# EAGLE design power_backup_v2 (EAGLE 6.5.0)
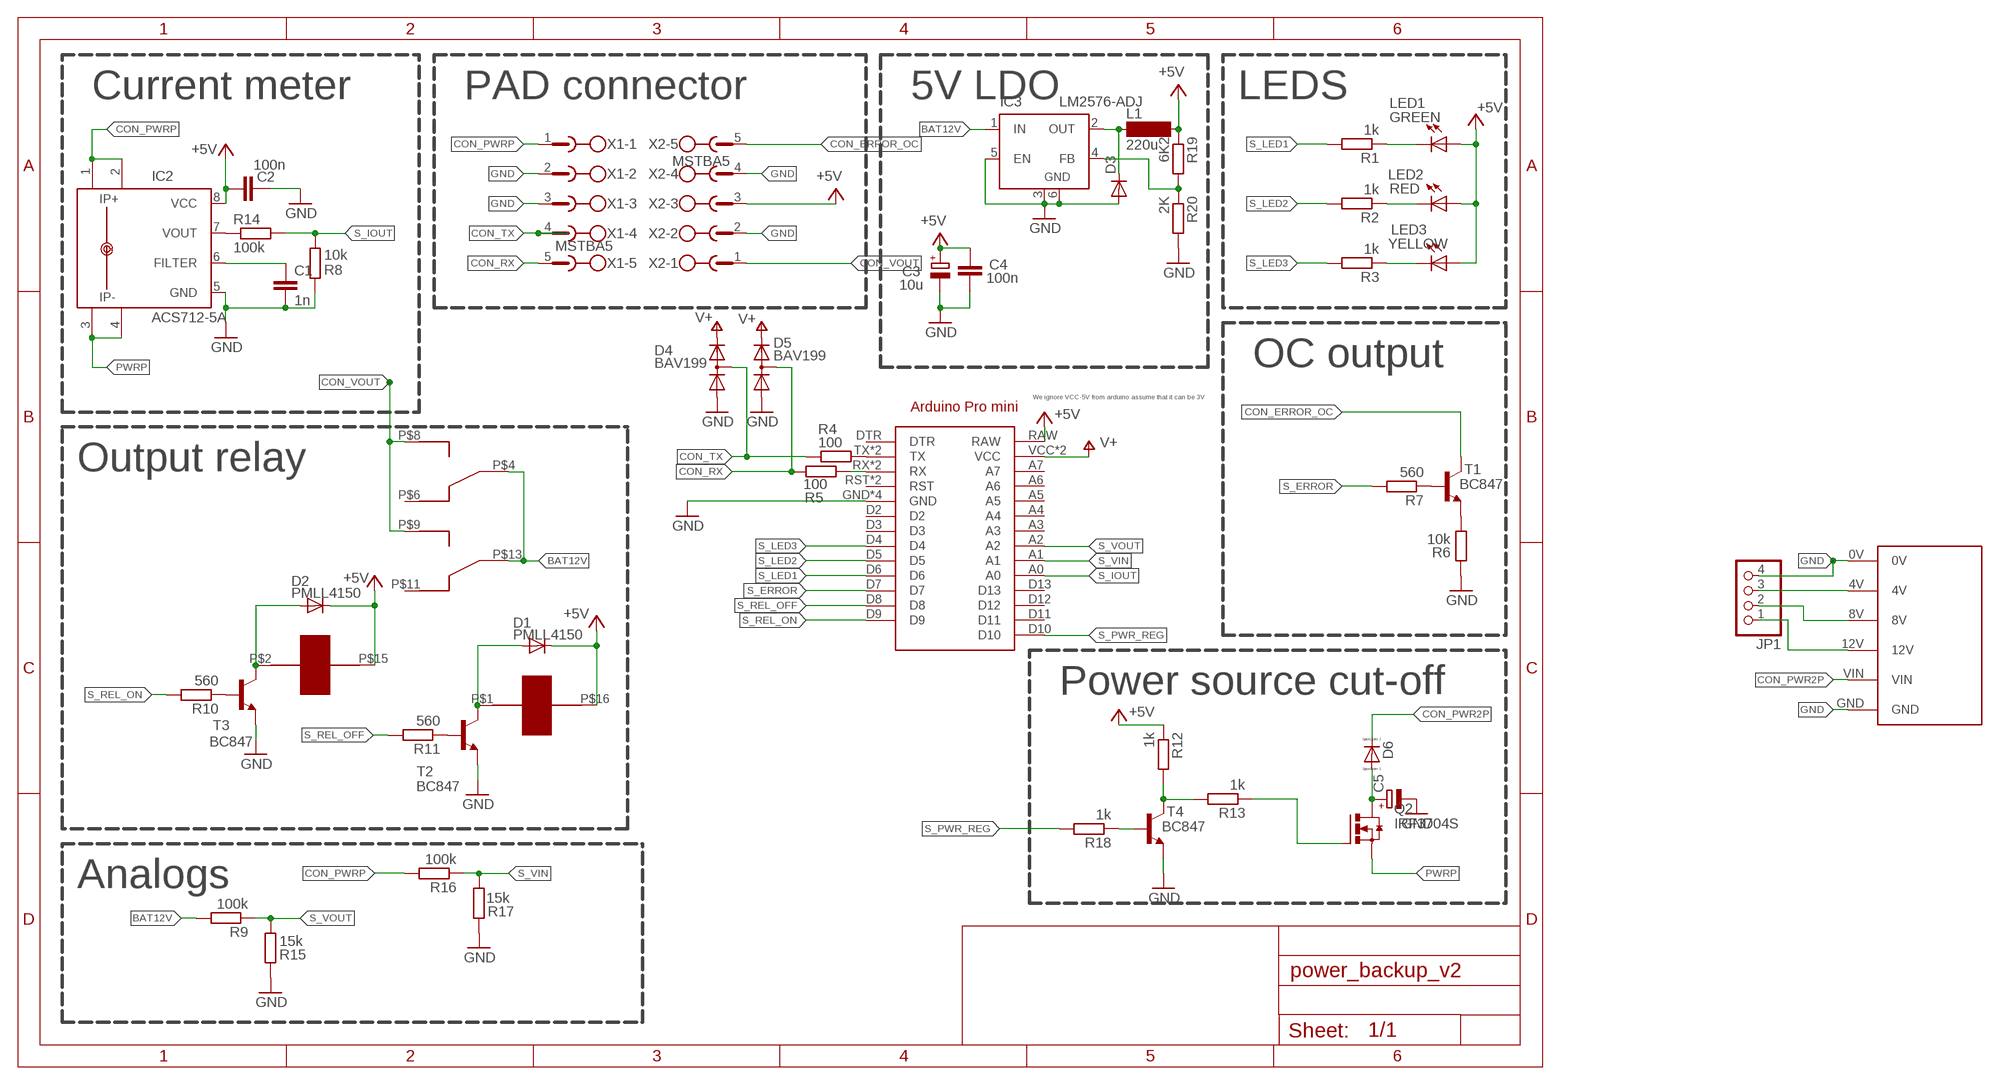
[diagram p0: schematic, sheet 1]

## Parts
ARDUINO1  ARDUINO_PRO_MINI  [ARDUINO_PRO_MINI]
C1  1n  C-EUC0805  [C0805]
C2  100n  C-EUC0805  [C0805]
C3  10u  CPOL-EUSMCC  [SMC_C]
C4  100n  C-EUC0805  [C0805]
C5  CPOL-EUE3.5-8  [E3,5-8]
D1  PMLL4150  [SOD80C]
D2  PMLL4150  [SOD80C]
D3  DIODE-DO214AA  [DO214AA]
D4  BAV199  [SOT23]
D5  BAV199  [SOT23]
D6  DIODE_E-SMC  [DIODE_SMC]
IC2  ACS712-5A  ACS712-LC  [SOIC8]
IC3  LM2576-ADJ  LM2596S  [TO263-5]
JP1  PINHD-1X4  [1X04]
K2  HFD2/003  [RELAY]
L1  220u  MS85  [MS85]
LED1  GREEN  LED3MM  [LED3MM]
LED2  RED  LED3MM  [LED3MM]
LED3  YELLOW  LED3MM  [LED3MM]
Q2  IRF3704S  [D2PACK]
R1  1k  R-EU_M0805  [M0805]
R2  1k  R-EU_M0805  [M0805]
R3  1k  R-EU_M0805  [M0805]
R4  100  R-EU_M0805  [M0805]
R5  100  R-EU_M0805  [M0805]
R6  10k  R-EU_M0805  [M0805]
R7  560  R-EU_M0805  [M0805]
R8  10k  R-EU_M0805  [M0805]
R9  100k  R-EU_M0805  [M0805]
R10  560  R-EU_M0805  [M0805]
R11  560  R-EU_M0805  [M0805]
R12  1k  R-EU_M0805  [M0805]
R13  1k  R-EU_M0805  [M0805]
R14  100k  R-EU_M0805  [M0805]
R15  15k  R-EU_M0805  [M0805]
R16  100k  R-EU_M0805  [M0805]
R17  15k  R-EU_M0805  [M0805]
R18  1k  R-EU_M0805  [M0805]
R19  6K2  R-EU_M0805  [M0805]
R20  2K  R-EU_M0805  [M0805]
T1  BC847  [SOT23]
T2  BC847  [SOT23]
T3  BC847  [SOT23]
T4  BC847  [SOT23]
U$1  BALANCER  [BALANCER]
X1  MSTBA5  [MSTBA5]
X2  MSTBA5  [MSTBA5]

## Nets
+5V: ARDUINO1.RAW C2.1 C3.+ C4.1 D1.C D2.C IC2.8(VCC) K2.P$15 K2.P$16 L1.2 LED1.A LED2.A LED3.A R12.1 R19.1 X2.3
BAT4V: JP1.3 U$1.4V
BAT8V: JP1.2 U$1.8V
BAT12V: IC3.1(IN) JP1.1 K2.P$4(MID) K2.P$13(MID) R9.2 U$1.12V
CON_ERROR_OC: T1.3(C) X2.5
CON_PWR2P: D6.C(A) U$1.VIN
CON_PWRP: IC2.1(IP+) IC2.2(IP+1) R16.2 X1.1
CON_RX: D5.3(AC) R5.1 X1.5
CON_TX: D4.3(AC) R4.1 X1.4
CON_VOUT: K2.P$8(NO) K2.P$9(NO) X2.1
GND: ARDUINO1.GND ARDUINO1.GND@1(GND) ARDUINO1.GND@2(GND) ARDUINO1.GND@3(GND) C1.2 C2.2 C3.- C4.2 C5.- D3.A D4.1(A) D5.1(A) IC2.5(GND) IC3.3(GND) IC3.5(EN) IC3.6(GND) JP1.4 R6.1 R8.2 R15.2 R17.2 R20.2 T2.2(E) T3.2(E) T4.2(E) U$1.0V U$1.GND X1.2 X1.3 X2.2 X2.4
N$1: LED1.K(C) R1.1
N$2: LED2.K(C) R2.1
N$3: LED3.K(C) R3.1
N$4: C5.+ D6.A(C) Q2.2(D)
N$6: D1.A K2.P$1 T2.3(C)
N$7: D2.A K2.P$2 T3.3(C)
N$8: R10.1 T3.1(B)
N$9: R11.1 T2.1(B)
N$10: R12.2 R13.2 T4.3(C)
N$11: Q2.1(G) R13.1
N$12: C1.1 IC2.6(FILTER)
N$13: IC2.7(VOUT) R14.1
N$14: R7.1 T1.1(B)
N$15: R6.2 T1.2(E)
N$16: R18.1 T4.1(B)
N$17: ARDUINO1.TX ARDUINO1.TX@1(TX) R4.2
N$18: ARDUINO1.RX ARDUINO1.RX@1(RX) R5.2
N$22: D3.C IC3.2(OUT) L1.1
N$23: IC3.4(FB) R19.2 R20.1
PWRP: IC2.3(IP-) IC2.4(IP-1) Q2.3(S)
S_ERROR: ARDUINO1.D7 R7.2
S_IOUT: ARDUINO1.A0 R8.1 R14.2
S_LED1: ARDUINO1.D6 R1.2
S_LED2: ARDUINO1.D5 R2.2
S_LED3: ARDUINO1.D4 R3.2
S_PWR_REG: ARDUINO1.D10 R18.2
S_REL_OFF: ARDUINO1.D8 R11.2
S_REL_ON: ARDUINO1.D9 R10.2
S_VIN: ARDUINO1.A1 R16.1 R17.1
S_VOUT: ARDUINO1.A2 R9.1 R15.1
V+: ARDUINO1.VCC ARDUINO1.VCC@1(VCC) D4.2(C) D5.2(C)
Unconnected: ARDUINO1.A3 ARDUINO1.A4 ARDUINO1.A5 ARDUINO1.A6 ARDUINO1.A7 ARDUINO1.D2 ARDUINO1.D3 ARDUINO1.D11 ARDUINO1.D12 ARDUINO1.D13 ARDUINO1.DTR ARDUINO1.RST ARDUINO1.RST@1(RST) K2.P$6(NC) K2.P$11(NC)

## Notes on the sheet
- Current meter | PAD connector | 5V LDO | LEDS
- OC output
- We ignore VCC-5V from arduino assume that it can be 3V
- Output relay
- Power source cut-off
- Analogs

## Library data of the parts
ARDUINO1 = arduinopromini:ARDUINO_PRO_MINI: For creating Arduino Pro Mini shields
C1 C2 C4 = rcl:C-EU: CAPACITOR, European symbol
C3 C5 = rcl:CPOL-EU: POLARIZED CAPACITOR, European symbol
D1 D2 = diode:PMLL4150: DIODE high speed
D3 = diode:DIODE-: DIODE
D4 D5 = diode:BAV199: DIODE low-leakage double diode
D6 = eagle-ltspice:DIODE_E-: Schottky Diode; SPICEMODEL: diode; SPICEPREFIX: D
IC2 = allegro-2:ACS712-LC
IC3 = linear:LM2596S: STEP-DOWN VOLTAGE REGULATOR
JP1 = pinhead:PINHD-1X4: PIN HEADER
K2 = relay_hfd2:HFD2/003
L1 = inductor-neosid:MS85: INDUCTOR SMD power inductor; OC_FARNELL: unknown; OC_NEWARK: unknown
LED1-LED3 = led:LED: LED OSRAM: - CHIPLED LG R971, LG N971, LY N971, LG Q971, LY Q971, LO R971, LY R971 LH N974, LH R974 LS Q976, LO Q976, LY Q976 LO Q996 - Hyper CHIPLED LW Q18S LB Q993, LB Q99A, LB R99A - SideLED LS A670, LO A670, LY A670, LG A670, LP A670 LB A673, LV A673, LT A673, LW A673 LH A674 LY A675 LS A676, LA A676, LO A676, LY A676, LW A676 LS A679, LY A679, LG A679 - Hyper Micro SIDELED® LS Y876, LA Y876, LO Y876, LY Y876 LT Y87S - SmartLED LW L88C, LW L88S LB L89C, LB L89S, LG L890 LS L89K, LO L89K, LY L89K LS L896, LA L896, LO L896, LY L896 - TOPLED LS T670, LO T670, LY T670, LG T670, LP T670 LSG T670, LSP T670, LSY T670, LOP T670, LYG T670 LG T671, LOG T671, LSG T671 LB T673, LV T673, LT T673, LW T673 LH T674 LS T676, LA T676, LO T676, LY T676, LB T676, LH T676, LSB T676, LW T676 LB T67C, LV T67C, LT T67C, LS T67K, LO T67K, LY T67K, LW E67C LS E67B, LA E67B, LO E67B, LY E67B, LB E67C, LV E67C, LT E67C LW T67C LS T679, LY T679, LG T679 LS T770, LO T770, LY T770, LG T770, LP T770 LB T773, LV T773, LT T773, LW T773 LH T774 LS E675, LA E675, LY E675, LS T675 LS T776, LA T776, LO T776, LY T776, LB T776 LHGB T686 LT T68C, LB T68C - Hyper Mini TOPLED® LB M676 - Mini TOPLED Santana® LG M470 LS M47K, LO M47K, LY M47K Source: http://www.osram.convergy.de LUXEON: - LUMILED® LXK2-PW12-R00, LXK2-PW12-S00, LXK2-PW14-U00, LXK2-PW14-V00 LXK2-PM12-R00, LXK2-PM12-S00, LXK2-PM14-U00 LXK2-PE12-Q00, LXK2-PE12-R00, LXK2-PE12-S00, LXK2-PE14-T00, LXK2-PE14-U00 LXK2-PB12-K00, LXK2-PB12-L00, LXK2-PB12-M00, LXK2-PB14-N00, LXK2-PB14-P00, LXK2-PB14-Q00 LXK2-PR12-L00, LXK2-PR12-M00, LXK2-PR14-Q00, LXK2-PR14-R00 LXK2-PD12-Q00, LXK2-PD12-R00, LXK2-PD12-S00 LXK2-PH12-R00, LXK2-PH12-S00 LXK2-PL12-P00, LXK2-PL12-Q00, LXK2-PL12-R00 Source: www.luxeon.com KINGBRIGHT: KA-3528ASYC Source: www.kingbright.com
Q2 = transistor-power:IRF3704: SMPS MOSFET HEXFET® Power MOSFET Source: http://www.irf.com/product-info/datasheets/data/irf3704.pdf
R1-R20 = rcl:R-EU_: RESISTOR, European symbol
T1-T4 = transistor:BC847: NPN TRANSISTOR
U$1 = balancer20a:BALANCER
X1 X2 = con-phoenix-508:MSTBA5: PHOENIX; MPN: 1757271; OC_FARNELL: 3705201; OC_NEWARK: 71C4164

## Board
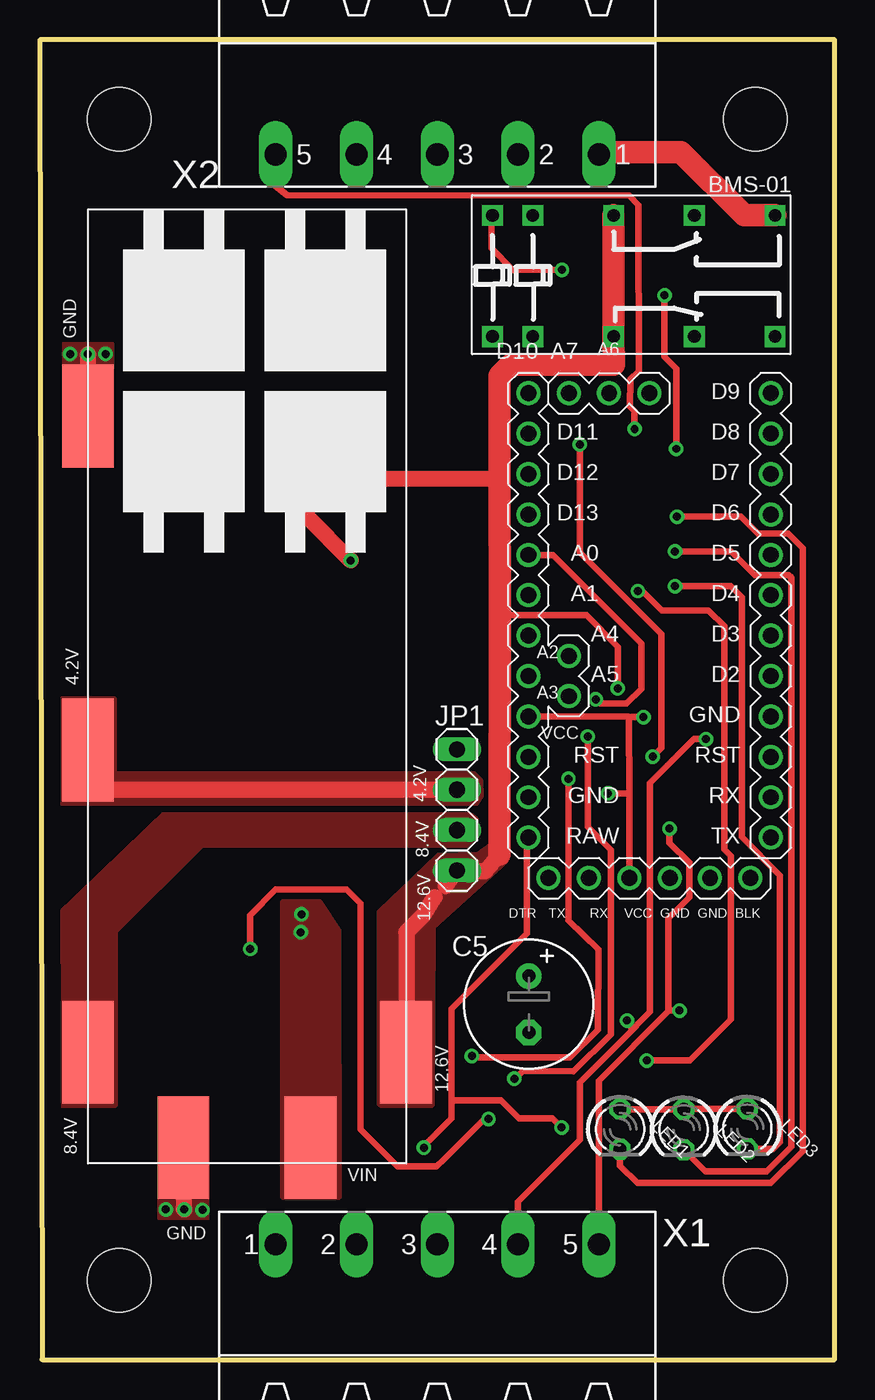
[diagram p1: board, top side]
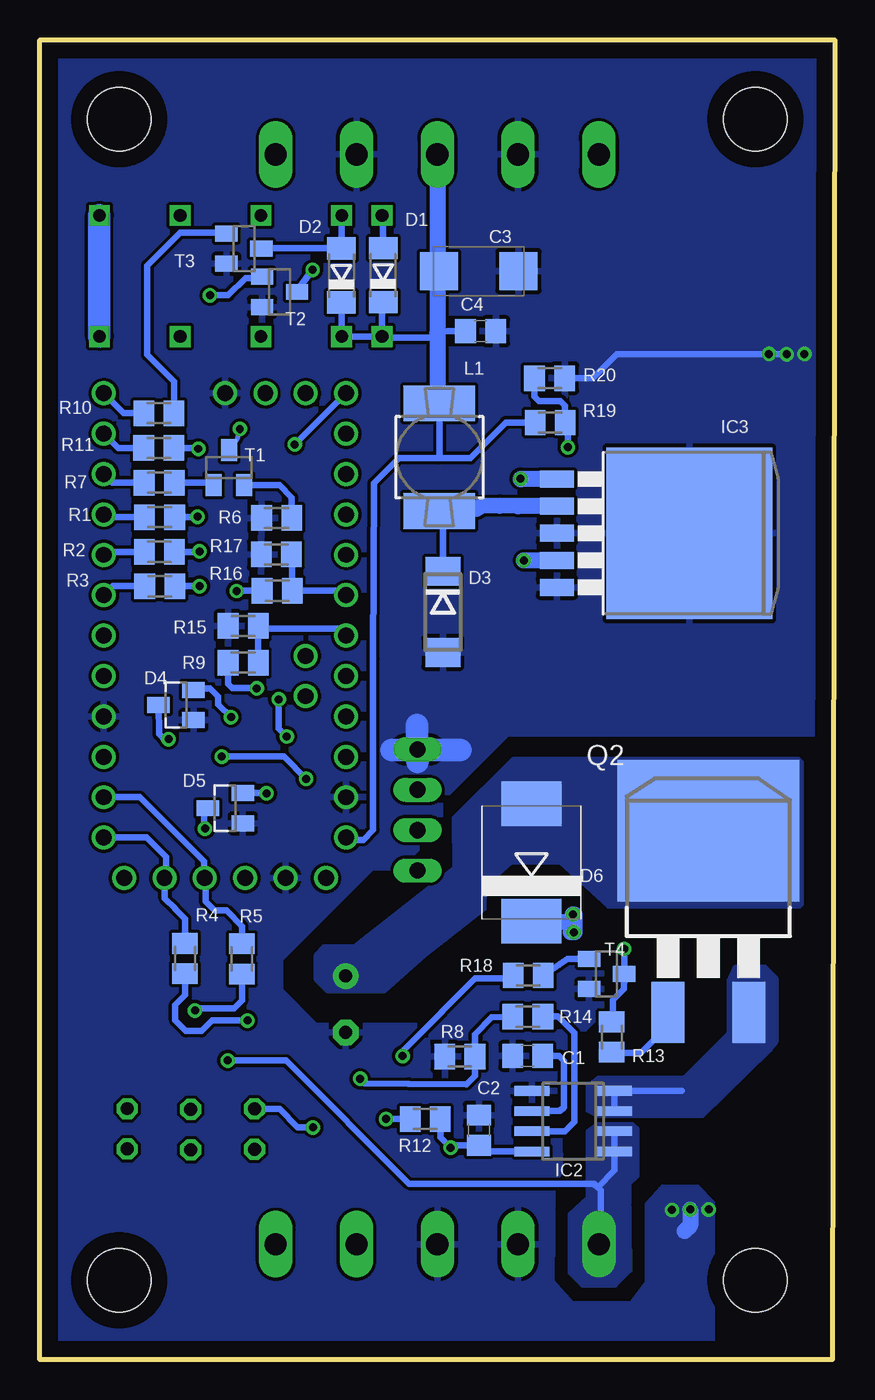
[diagram p2: board, bottom side, seen from below]

Size 50 x 83 mm. Coordinates in mm from the lower left corner, seen from the top.
Outline: 0.15,0 50,0 50,83 0,83 0.15,0
Copper layers (1*16): Top 0.035mm / dielectric 1.5mm / Bottom 0.035mm
Design rules "default": minimum track width 10mil, minimum drill 24mil, track to track 8mil, track to pad 8mil, pad to pad 8mil, via to via 8mil, smd to smd 8mil, copper to edge 40mil, drill to drill 8mil, minimum pad ring 10mil, minimum via ring 8mil, stop-mask expansion 4mil, vias tented up to drill 0mil, thermal gap 10mil
Holes 4 mm at 5,5 45,5 5,78 45,78

### Footprints (pad centres in the part's own frame; a part is rotated, then mirrored left to right if it is on the bottom)
ARDUINO_PRO_MINI = drill 1: A0 11.43,-8.89; A1 11.43,-6.35; A2 11.43,-3.81; A3 11.43,-1.27; A4 8.89,-2.54; A5 8.89,0; A6 6.35,-19.05; A7 8.89,-19.05; BLK 10.16,11.43; D2 -3.81,-1.27; D3 -3.81,-3.81; D4 -3.81,-6.35; D5 -3.81,-8.89; D6 -3.81,-11.43; D7 -3.81,-13.97; D8 -3.81,-16.51; D9 -3.81,-19.05; D10 11.43,-19.05; D11 11.43,-16.51; D12 11.43,-13.97; D13 11.43,-11.43; DTR -2.54,11.43; GND -3.81,1.27; GND@1 11.43,6.35; GND@2 7.62,11.43; GND@3 3.81,-19.05; RAW 11.43,8.89; RST 11.43,3.81; RST@1 -3.81,3.81; RX -3.81,6.35; RX@1 2.54,11.43; TX -3.81,8.89; TX@1 0,11.43; VCC 11.43,1.27; VCC@1 5.08,11.43
C0805 = smd 1.3 x 1.5: 1 -0.95,0; 2 0.95,0
SMC_C = smd 2.4 x 2.4: + -2.5,0; - 2.5,0
E3,5-8 = drill 0.813 pad 1.6: + -1.778,0 | drill 0.813 pad 1.6 octagon: - 1.778,0
SOD80C = smd 1.4 x 1.8: A 1.7,0; C -1.7,0
DO214AA = smd 1.8 x 2.2: A 2.55,0; C -2.55,0
SOT23 = smd 1 x 1.4: 1 -0.95,-1.1; 2 0.95,-1.1; 3 0,1.1
DIODE_SMC = smd 2.8 x 3.8: A 3.7,0; C -3.7,0
SOIC8 = smd 0.6 x 2.2: 1 -1.905,-2.6; 2 -0.635,-2.6; 3 0.635,-2.6; 4 1.905,-2.6; 5 1.905,2.6; 6 0.635,2.6; 7 -0.635,2.6; 8 -1.905,2.6
TO263-5 = smd 1.067 x 2.159: 1 -3.404,-5.791; 2 -1.702,-5.791; 3 0,-5.791; 4 1.702,-5.791; 5 3.404,-5.791 | smd 10.8 x 10.41: 6 0,2.54
1X04 = drill 1.016 long: 1 -3.81,0; 2 -1.27,0; 3 1.27,0; 4 3.81,0
RELAY = drill 0.8 square: P$1 1.27,1.27; P$2 1.27,3.81; P$4 1.27,8.89; P$6 1.27,13.97; P$8 1.27,19.05; P$9 8.89,19.05; P$11 8.89,13.97; P$13 8.89,8.89; P$15 8.89,3.81; P$16 8.89,1.27
MS85 = smd 4.5 x 2.25: 1 0,-3.383; 2 0,3.383
LED3MM = drill 0.813 octagon: A -1.27,0; K 1.27,0
D2PACK = smd 2.083 x 3.81: 1 -2.54,-8.89; 3 2.54,-8.89 | smd 11.43 x 8.89: 2 0,2.54
M0805 = smd 1.3 x 1.6: 1 -0.95,0; 2 0.95,0
BALANCER = smd 3.251 x 6.452: 0V 20,13; 4V 20,34; 8V 20,53; 12V 0,53; GND 14,59; VIN 6,59
MSTBA5 = drill 1.397 long: 1 -10.16,5.08; 2 -5.08,5.08; 3 0,5.08; 4 5.08,5.08; 5 10.16,5.08

### Placement (x,y rotation side)
ARDUINO1  42.16,41.72 180 top
C1  19.31,19.11 180 bottom
C2  22.38,14.43 90 bottom
C3  22.4,68.45 0 bottom
C4  22.27,64.67 0 bottom
C5  30.76,22.35 270 top
D1  28.4,68.2 90 bottom
D2  31.03,68.18 90 bottom
D3  24.65,47.02 270 bottom
D4  41.43,41.17 90 bottom
D5  38.33,34.68 90 bottom
D6  19.08,31.27 90 bottom
IC2  16.46,15 90 bottom
IC3  11.68,51.97 270 bottom
JP1  26.24,34.57 90 top
K2  27.2,73.23 270 top
L1  24.87,56.75 0 bottom
LED1  36.5,14.5 270 top
LED2  40.5,14.47 270 top
LED3  44.5,14.52 270 top
Q2  7.95,30.73 0 bottom
R1  42.46,52.98 180 bottom
R2  42.47,50.8 180 bottom
R3  42.45,48.64 180 bottom
R4  40.86,25.23 90 bottom
R5  37.28,25.2 90 bottom
R6  35.1,52.93 0 bottom
R7  42.48,55.15 180 bottom
R8  23.58,19.07 180 bottom
R9  37.21,43.83 180 bottom
R10  42.51,59.52 180 bottom
R11  42.52,57.33 180 bottom
R12  25.76,15.14 180 bottom
R13  14.02,20.29 90 bottom
R14  19.3,21.58 180 bottom
R15  37.2,46.14 180 bottom
R16  35.07,48.36 180 bottom
R17  35.12,50.63 180 bottom
R18  19.28,24.17 180 bottom
R19  17.9,58.93 0 bottom
R20  17.93,61.72 0 bottom
T1  38.1,56.1 0 bottom
T2  34.92,67.15 270 bottom
T3  37.16,69.87 270 bottom
T4  14.35,24.26 270 bottom
U$1  23.04,72.34 180 top
X1  25,2.18 0 top
X2  25,80.87 180 top

### Tracks (layer width: path | path; a pad name or v marks a point on that pad's centre or on a via)
+5V  (via drill 0.5)
  Top 0.406: v24.16,13.34 24.16,13.44 25.88,15.16 25.88,16.16 | 25.88,16.16 25.88,22.05 30.64,26.8 30.64,32.74 ARDUINO1.RAW | v32.82,14.61 32.26,15.16 30.14,15.16 29,16.3 26.02,16.3 25.88,16.16 | LED3.A 40.55,15.79 LED2.A 36.53,15.74 LED1.A 36.39,15.77 36.34,15.82
  Bottom 0.406: D2.C 31.01,66.46 K2.P$15 K2.P$16 | K2.P$16 28.47,66.43 D1.C | IC2.8 22,13.1 C2.1 24.01,13.48 v24.16,13.34 24.81,13.98 R12.1 | ARDUINO1.RAW 30.59,32.69 29.64,32.69 29.03,33.32 29.03,44.09 28.99,55.11 27.41,56.69 24.9,56.69 | K2.P$16 28.55,64.26 25.1,64.26 25,64.36 | v32.82,14.61 33.78,14.62 34.93,15.77 LED1.A | C3.+ 24.9,64.64 | 24.9,64.64 25,64.54 | C4.1 24.35,64.67 24.9,64.64 | L1.2 24.87,56.72 24.9,56.69 | R19.1 20.68,58.93 22.92,56.69 24.9,56.69
  Bottom 0.61: K2.P$16 | 25,60.97 L1.2
  Bottom 1.016: 28.39,64.26 K2.P$16 | X2.3 25,64.54 25,64.36 25,60.97
BAT4V
  Top 1.016: JP1.3 3.53,35.84 2.69,36.68 2.69,37.99 U$1.4V
  pour Top (no thermals): 27.35,34.98 27.25,34.94 1.39,34.94 1.39,41.61 4.7,41.61 4.7,36.91 27.3,36.91 27.74,36.47 27.79,35.43 27.48,34.97
BAT8V
  pour Top (no thermals): 1.42,16.03 1.42,28.14 7.78,34.24 27.05,34.24 27.41,33.99 27.41,32.94 26.87,32.41 10.21,32.41 4.72,26.92 4.72,16.03
BAT12V  (via drill 0.5)
  Top 0.406: v36.36,42.21 36.35,44.83 34.37,46.81 28.63,46.81 28.93,47.08
  Top 1.016: U$1.12V 23.06,19.36 23.06,26.9 24.16,27.99 24.84,29.08 | 25.53,29.77 26.19,30.71 JP1.1 26.29,30.71 28.02,30.71 28.91,31.78 | v19.76,55.4 28.42,55.4 28.93,55.27
  Top 1.422: K2.P$4 K2.P$13 36.09,62.59 29.64,62.58 28.91,61.86 28.93,55.27 28.93,47.08 28.91,31.78
  Bottom 0.406: R9.2 38.16,42.5 37.9,42.24 36.58,42.24 v36.36,42.21
  Bottom 1.016: IC3.1 19.74,55.37 v19.76,55.4
  pour Top (no thermals): 21.41,16.08 21.39,28.17 25.08,31.67 27.55,31.74 28.79,32.61 29.32,31.4 24.71,27.23 24.64,16.03 21.49,16.03 21.44,16.08
CON_ERROR_OC  (via drill 0.5)
  Top 0.406: v37.41,58.53 37.41,59.64 37.11,59.94 37.13,61.65 37.67,62.18 37.66,72.03 37.66,72.61 37.08,73.19 15.56,73.21 14.63,73.94 14.63,75.58 X2.5
  Bottom 0.305: T1.3 37.56,57.92 v37.41,58.53
CON_PWR2P  (via drill 0.5)
  Bottom 1.016: v16.46,28.01 16.48,27.99 16.36,27.99 16.36,26.9 16.59,26.9 | 16.6,26.9 16.59,26.9 | 16.59,26.9 16.59,27.49 19.04,27.53 D6.C
  other vias: 16.42,26.88
  pour Top (no thermals): 15.56,28.75 17.59,28.77 18.75,27 18.8,10.25 15.29,10.25 15.29,28.76
CON_PWRP  (via drill 0.5)
  Top 0.406: v37.62,48.34 37.9,48.34 39.12,47.12 42.06,47.12 43.05,46.13 43.05,32.08 43.46,31.67 43.46,24.11 43.48,24.08 43.48,21.41 40.89,18.82 v38.18,18.82
  Bottom 0.406: R16.2 37.6,48.36 v37.62,48.34 | v38.18,18.82 34.52,18.82 26.77,11.07 15.14,11.07 14.91,10.85 | 14.91,10.85 14.71,10.64 14.71,7.4 X1.1 | IC2.2 IC2.1 13.86,11.9 14.91,10.85
  pour Bottom (no thermals): 12.73,14.81 14.96,14.81 15.54,14.35 15.54,10.19 16.69,9.14 16.69,5.49 15.88,4.67 13.79,4.67 12.85,5.61 12.9,11.05 12.42,11.53 12.42,14.55
CON_RX  (via drill 0.5)
  Top 0.406: X1.5 35.16,11.96 35.15,12.95 35.15,17.55 39.52,21.95 | 39.52,21.95 39.52,27.76 40.84,29.08 40.84,31.27 39.61,32.5 v39.61,33.4 | v40.23,21.96 39.54,21.96 39.52,21.95
  Bottom 0.406: D5.3 39.66,34.68 39.66,33.45 v39.61,33.4 | R5.1 37.28,22.59 37.77,22.1 40.09,22.1 v40.23,21.96
CON_TX  (via drill 0.5)
  Top 0.406: X1.4 30.07,9.93 33.96,13.82 33.96,17.45 37.3,20.79 | 37.3,20.79 37.8,21.3 38.38,21.88 38.38,31.39 38.38,36.26 41.14,39.02 v41.91,39.02 | v36.94,21.33 36.94,21.14 37.3,20.79
  Bottom 0.406: R4.1 40.86,22.93 41.47,22.32 41.47,21.33 40.81,20.67 39.82,20.67 39.16,21.33 v36.94,21.33 | v41.91,39.02 42.14,38.97 42.49,39.34 D4.3
CON_VOUT
  Top 1.27: K2.P$8
  Top 1.422: K2.P$8 44.3,71.96 40.34,75.92 35.29,75.92 X2.1
  Bottom 1.422: K2.P$9 K2.P$8
GND  (via drill 0.5)
  Top 1.016: U$1.GND 9.04,9.5 v9.09,9.45 | U$1.0V 3.04,63.2 v3.02,63.22
  Bottom 0.406: R20.2 15.21,61.72 13.72,63.22 v3.02,63.22
  Bottom 1.016: v9.09,9.45 9.09,8.43 9.45,8.08
  Bottom 1.422: 26.26,39.9 26.24,37.59 | 23.55,38.35 27.89,38.33
  other vias: 1.91,63.25 4.14,63.25 7.92,9.45 10.24,9.42
  pour Bottom: -1.04,84.07 50.39,84.07 50.39,-1.04 17.25,-1.07 9.19,-1.07 7.72,0.41 7.72,9.88 8.64,10.79 10.82,10.79 11.76,9.78 11.76,4.8 12.73,3.53 16.54,3.48 17.81,4.93 17.75,11.07 17.3,11.79 17.37,19.18 14.71,21.84 14.71,26.75 20.02,26.7 25.73,20.98 32.64,20.98 34.9,23.24 34.9,25.17 29.11,30.96 27.43,30.96 24.82,33.58 24.82,35.13 20.57,39.37 0.13,39.37 -1.14,40.64 -1.04,83.82
  pour Top (no thermals): 1.52,63.91 4.55,63.91 4.55,62.31 1.52,62.31
  pour Top (no thermals): 7.53,10.41 10.54,10.41 10.54,8.89 7.53,8.89
N$1  (via drill 0.5)
  Top 0.406: v40.08,53.01 44.09,53.01 45.16,51.94 47.09,51.94 47.98,51.05 47.98,13.1 45.99,11.11 37.59,11.11 36.5,12.2 LED1.K
  Bottom 0.406: R1.1 40.11,52.98 v40.08,53.01
N$2  (via drill 0.5)
  Top 0.406: v39.95,50.83 43.48,50.83 44.96,49.35 47.09,49.35 47.27,49.17 47.27,13.39 45.72,11.84 41.86,11.84 LED2.K
  Bottom 0.406: R2.1 39.98,50.8 v39.95,50.83
N$3  (via drill 0.5)
  Top 0.406: v39.95,48.64 43.46,48.64 44.15,47.95 44.15,32.87 46.56,30.45 46.56,13.68 46.13,13.25 LED3.K
  Bottom 0.406: R3.1 v39.96,48.64 v39.95,48.64
N$4
  Bottom 1.016: 9.64,34.97 Q2.2
  pour Bottom (no thermals): 2.29,37.77 20.24,37.77 23.99,34.06 23.95,30.92 30.22,25.99 32.16,25.98 32.64,25.45 32.64,23.9 31.92,23.18 28.32,23.16 25.78,25.44 21.99,28.37 21.97,29.82 20.35,31.27 17.3,31.27 14.25,28.5 2.21,28.5 2.03,28.68 2.03,37.54 2.29,37.8
N$6  (via drill 0.5)
  Top 0.406: v32.84,68.53 29.76,68.52 D1.A 28.4,71.89 K2.P$1
  Bottom 0.406: D1.A 28.4,71.89 K2.P$1 | T2.3 33.82,67.22 v32.84,68.53
N$7
  Bottom 0.406: K2.P$2 31.03,71.94 D2.A 36.05,69.88 T3.3
N$8
  Bottom 0.305: 38.3,70.87 T3.1
  Bottom 0.406: R10.1 41.56,61.52 43.23,63.19 43.23,68.81 41.17,70.87 38.3,70.87
N$9  (via drill 0.5)
  Top 0.406: v40.03,57.28 40.03,62.33 39.29,63.07 v39.29,66.93
  Bottom 0.305: 36.25,67.87 T2.1
  Bottom 0.406: R11.1 40.09,57.33 v40.03,57.28 | v39.29,66.93 38.15,66.93 37.06,68.02 36.1,68.02 T2.1
N$10  (via drill 0.5)
  Top 0.406: v28.22,15.14 27.96,15.14 25.83,13.01 25.41,12.61 24.96,12.16 22.51,12.16 20.17,14.5 20.17,28.7 19.31,29.56 14.84,29.56 13.22,27.94 13.22,25.84 v13.23,25.83
  Bottom 0.406: T4.3 13.25,23.75 | 13.25,23.75 13.25,23.32 13.95,22.63 13.95,21.32 R13.2 | 13.25,23.75 13.23,23.77 v13.23,25.83 | R12.2 v28.22,15.14
N$11
  Bottom 0.406: Q2.1 10.49,21.01 12.19,19.3 13.98,19.3 R13.1
N$12
  Bottom 0.406: IC2.6 17.28,15.64 17.04,15.88 17.04,18.8 17.34,19.12 18.38,19.12 C1.1
N$13
  Bottom 0.406: IC2.7 16.98,14.37 16.38,14.96 16.38,20.55 17.4,21.59 18.54,21.59 R14.1
N$14
  Bottom 0.406: R7.1 39.2,55.15 T1.1
N$15
  Bottom 0.406: R6.2 34.15,54.22 34.92,54.99 T1.2
N$16
  Bottom 0.406: T4.1 16.82,25.21 R18.1
N$17
  Bottom 0.406: ARDUINO1.TX 43.27,32.83 42.06,31.62 42.06,30.39 ARDUINO1.TX@1 42.13,30.26 42.13,29.02 41.5,28.39 41.5,28.36 40.86,27.72 R4.2
N$18
  Bottom 0.406: ARDUINO1.RX 43.7,35.37 39.67,31.34 39.67,30.35 ARDUINO1.RX@1 39.58,30.25 39.58,28.81 39.01,28.24 38.26,28.24 37.28,27.26 R5.2
N$22
  Bottom 0.406: D3.C 24.65,53.15 L1.1 24.99,53.49 25.43,53.49
  Bottom 1.016: IC3.2 19.91,53.67 21.07,53.7 22.22,53.68 22.53,53.49 25.43,53.49
N$23  (via drill 0.5)
  Top 1.016: v16.78,57.38 16.78,53.04 v19.56,50.27
  Bottom 0.406: v16.78,57.38 16.83,59.14 | 16.83,59.14 16.83,59.24 | R20.1 18.88,60.56 18.6,60.28 17.25,60.28 16.98,60.01 16.98,58.98 | R19.2 16.98,58.96 16.98,58.98 | 16.98,58.98 16.83,59.14
  Bottom 1.016: IC3.4 v19.56,50.27
PWRP
  Bottom 0.406: IC2.3 IC2.4 9.61,16.91 | 5.56,20.95 5.56,21.69 Q2.3
  pour Bottom (no thermals): 15.57,17.2 15.54,15.67 14.97,15.33 8.33,15.32 4.04,19.48 3.66,19.99 3.66,23.98 4.37,24.69 6.3,24.69 6.71,23.78 6.71,20.53 9.47,17.75 14.88,17.73
S_ERROR
  Bottom 0.406: R7.2 45.43,55.15 ARDUINO1.D7
S_IOUT  (via drill 0.5)
  Top 0.406: v34.98,41.53 35.26,41.25 36.91,41.25 37.85,42.19 37.85,45.03 32.27,50.61 ARDUINO1.A0 | v34.47,39.19 34.47,33.5 35.92,32.05 35.92,20.47 33.58,18.14 30.38,18.16 v29.85,17.66
  Bottom 0.406: R14.2 21.59,21.53 22.63,20.45 R8.1 | v34.98,41.53 34.98,39.7 v34.47,39.19 | 22.66,19.04 R8.1 | v29.85,17.66 29.58,17.39 26.81,17.35 23.16,17.32 22.63,17.86 R8.1
S_LED1
  Bottom 0.406: R1.2 45.8,52.98 ARDUINO1.D6
S_LED2
  Bottom 0.406: R2.2 45.78,50.8 ARDUINO1.D5
S_LED3
  Bottom 0.406: R3.2 45.4,48.64 ARDUINO1.D4
S_PWR_REG  (via drill 0.5)
  Top 0.406: v33.96,57.56 33.96,50.75 39.09,45.62 39.09,38.46 v38.56,37.92 | v33.25,36.52 33.25,27.61 35.13,25.79 35.1,20.75 33.35,19.02 27.25,19.02 v27.18,19.1
  Bottom 0.406: ARDUINO1.D10 30.75,60.77 v33.96,57.56 | v38.56,37.92 34.65,37.92 v33.25,36.52 | v27.18,19.1 27.18,19.41 24.71,21.87 24.71,21.89 22.63,23.98 20.51,23.98 R18.2
S_REL_OFF
  Bottom 0.406: R11.2 45.07,57.33 ARDUINO1.D8
S_REL_ON
  Bottom 0.406: R10.2 44.72,59.52 ARDUINO1.D9
S_VIN
  Bottom 0.406: ARDUINO1.A1 31.02,48.36 R16.1 34.12,50.58 R17.1
S_VOUT
  Bottom 0.406: R9.1 36.28,44.94 R15.1 36.32,45.87 35.92,45.97 31.17,45.97 ARDUINO1.A2
V+  (via drill 0.5)
  Top 0.406: ARDUINO1.VCC 37,40.45 37.05,40.41 | 37.05,40.41 v37.97,40.41 | ARDUINO1.VCC@1 37.08,35.48 | 37.08,35.48 37.05,40.41 | v35.74,35.61 36.95,35.61 37.08,35.48
  Bottom 0.406: D4.2 40.41,42.2 39.27,42.2 38.77,41.7 38.77,41.21 v37.97,40.41 | D5.2 35.76,35.63 v35.74,35.61

### Text on the board
tPlace: BMS-01
tNames: GND | 4.2V | 4.2V | 8.4V | 12.6V | 12.6V | 8.4V | VIN | GND